# EAGLE design V0p2_Main_PCB2 (EAGLE 6.5.0)
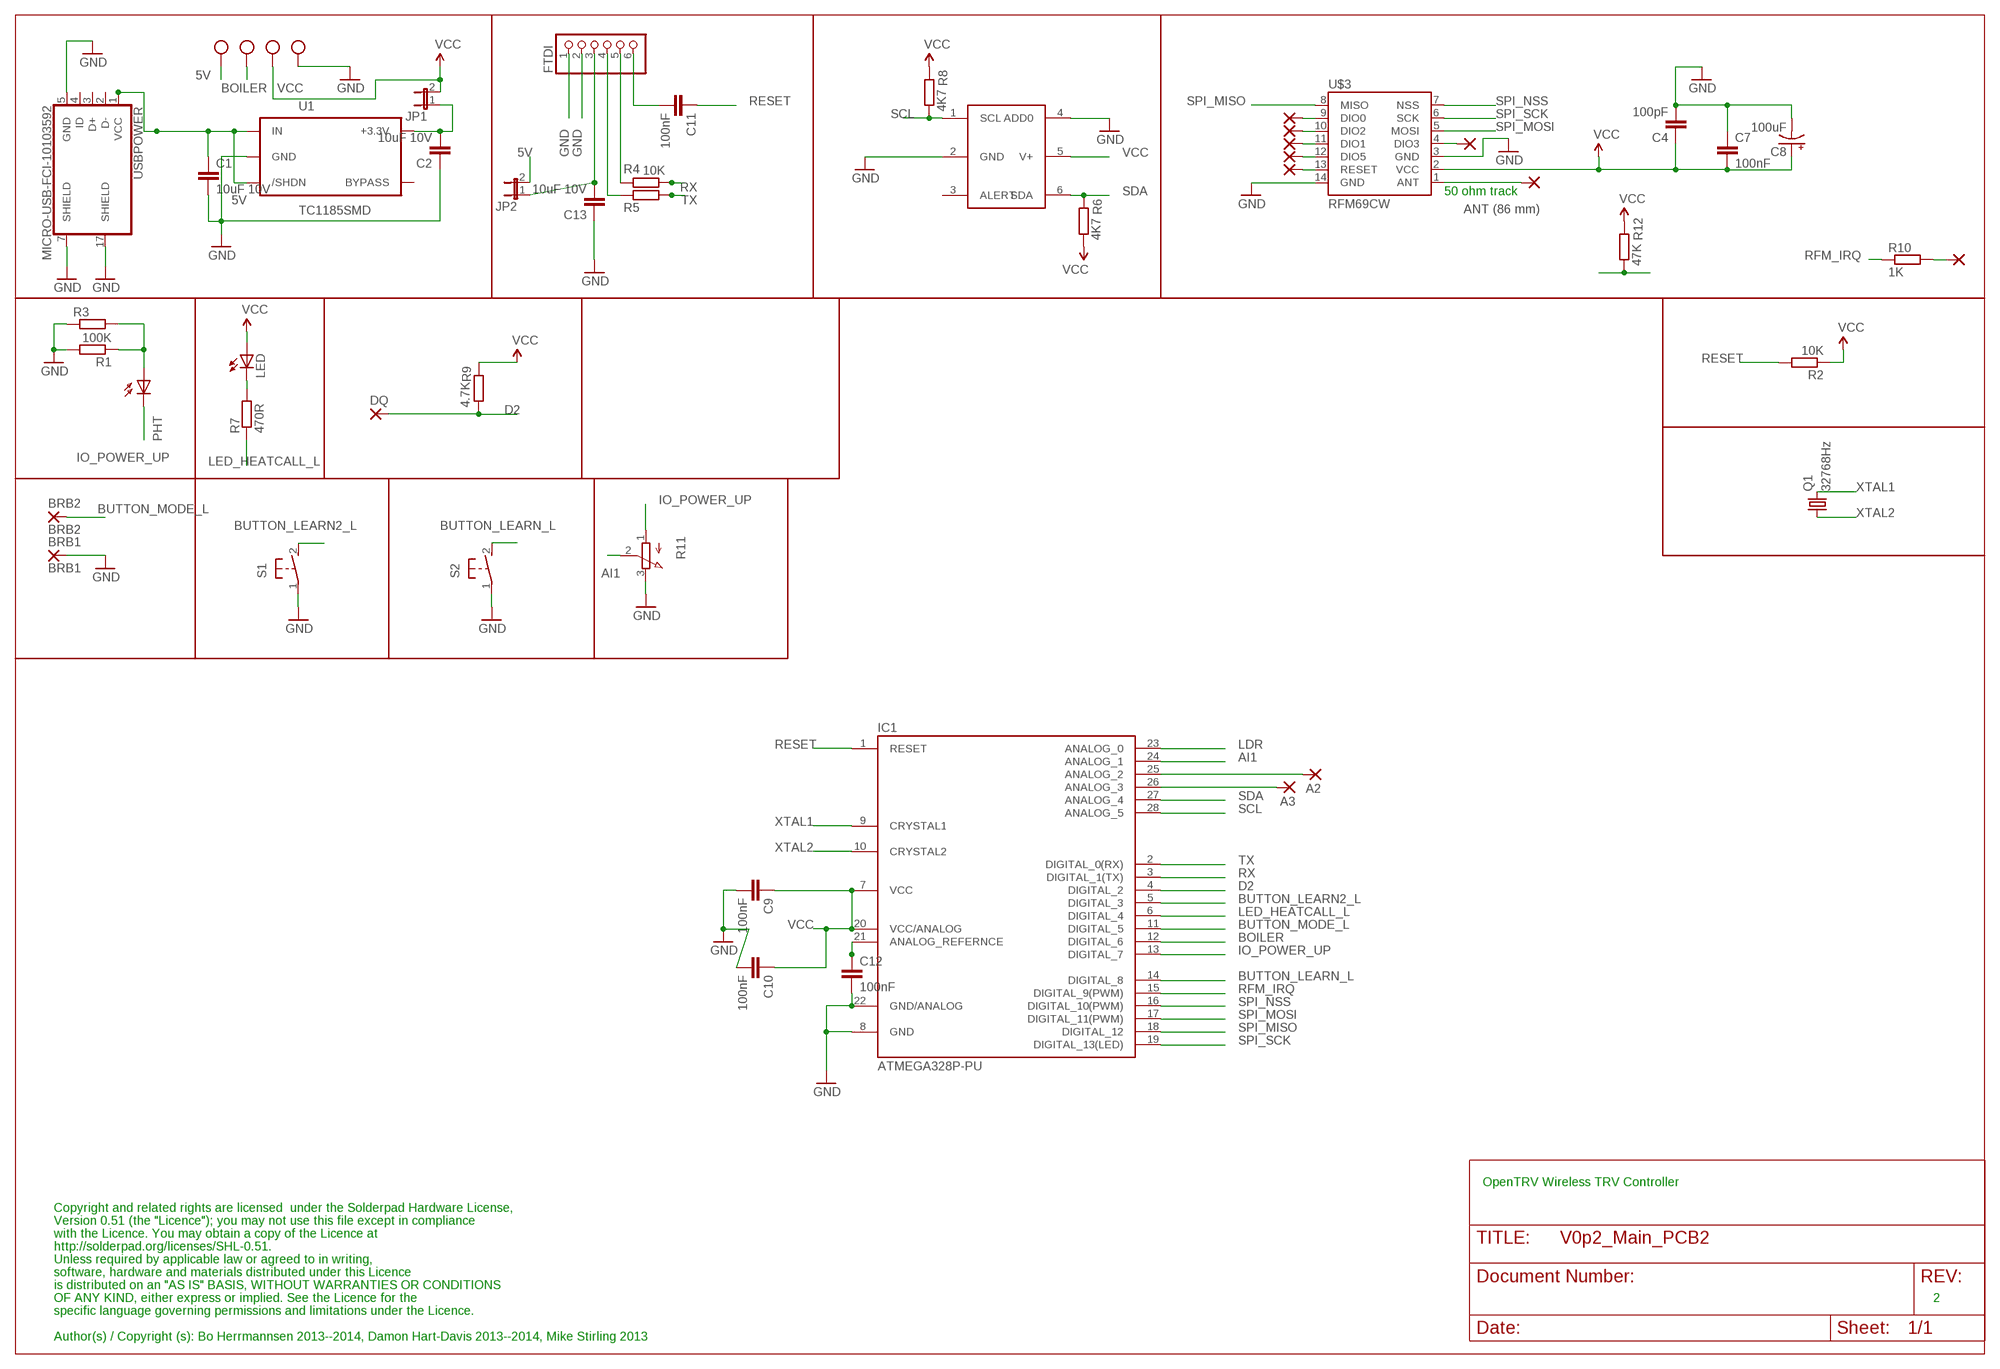
[diagram p0: schematic, sheet 1]

## Parts
A2  2,15/1,0  [2,15/1,0]
A3  2,15/1,0  [2,15/1,0]
ANT  ANT (86 mm)  2,15/1,0  [2,15/1,0]
BRB1  BRB1  2,15/1,0  [2,15/1,0]
BRB2  BRB2  2,15/1,0  [2,15/1,0]
C1  10uF 10V  C-EUC0603  [C0603]
C2  10uF 10V  C-EUC0603  [C0603]
C4  100pF  C-EUC0603  [C0603]
C7  100nF  C-EUC0603  [C0603]
C8  100uF  CAP_POL1206  [EIA3216]
C9  100nF  C-EUC0603  [C0603]
C10  100nF  C-EUC0603  [C0603]
C11  100nF  C-EUC0603  [C0603]
C12  100nF  C-EUC0603  [C0603]
C13  10uF 10V  C-EUC0603  [C0603]
DIO0  ANT (86 mm)  2,15/1,0  [2,15/1,0]
DIO1  ANT (86 mm)  2,15/1,0  [2,15/1,0]
DIO2  ANT (86 mm)  2,15/1,0  [2,15/1,0]
DIO3  ANT (86 mm)  2,15/1,0  [2,15/1,0]
DIO5  ANT (86 mm)  2,15/1,0  [2,15/1,0]
DQ  2,15/1,0  [2,15/1,0]
FTDI  PINHD-1X6/90  [1X06/90]
IC1  ATMEGA328P-PU  ATMEGA8-PU  [DIL28-3]
IRQ  ANT (86 mm)  2,15/1,0  [2,15/1,0]
JP1  JP1E  [JP1]
JP2  JP1E  [JP1]
LED  LED3MM  [LED3MM]
PHT  BPX65  [BPX65]
Q1  32768Hz  MC-306  [MC-306]
R1  100K  R-EU_R0603  [R0603]
R2  10K  R-EU_R0603  [R0603]
R3  R-EU_0309/V  [0309V]
R4  10K  R-EU_R0603  [R0603]
R5  10K  R-EU_R0603  [R0603]
R6  4K7  R-EU_R0603  [R0603]
R7  470R  R-EU_R0603  [R0603]
R8  4K7  R-EU_R0603  [R0603]
R9  4.7K  R-EU_R0603  [R0603]
R10  1K  R-EU_R0603  [R0603]
R11  EVUE2A  [EVUE]
R12  47K  R-EU_R0603  [R0603]
RST  ANT (86 mm)  2,15/1,0  [2,15/1,0]
S1  31-XX  [B3F-31XX]
S2  31-XX  [B3F-31XX]
TMP1  TMP1  TMP112  [TMP112]
U1  TC1185SMD  [TC1185]
U$3  RFM69CW  RFM69SMD  [RFM69]
USBPOWER  MICRO-USB-FCI-10103592  [MICRO-USB-FCI-10103592]
X1  W237-102  [SCREWTERMINAL]
X2  W237-102  [SCREWTERMINAL]

## Nets
5V [supply]: C1.1 JP2.2 U1.1(IN) U1.3(/SHDN) USBPOWER.1(VCC) X1.2
AI1: IC1.24(ANALOG_1) R11.2(S)
BOILER: IC1.12(DIGITAL_6) X1.1
BUTTON_LEARN2_L: IC1.5(DIGITAL_3) S1.2(S)
BUTTON_LEARN_L: IC1.14(DIGITAL_8) S2.2(S)
BUTTON_MODE_L: BRB2.1(P) IC1.11(DIGITAL_5)
D2: DQ.1(P) IC1.4(DIGITAL_2) R9.1
GND [supply]: BRB1.1(P) C1.2 C2.1 C4.2 C7.1 C8.C(-) C9.2 C10.2 C12.2 C13.1 FTDI.1 FTDI.2 IC1.8(GND) IC1.22(GND/ANALOG) R1.2 R3.1 R11.3(E) S1.1(P) S2.1(P) TMP1.2(GND) TMP1.4(ADD0) U1.2(GND) U$3.3(GND) U$3.14(GND) USBPOWER.5(GND) USBPOWER.7(SHIELD) USBPOWER.17(SHIELD) X2.2
IO_POWER_UP [supply]: IC1.13(DIGITAL_7) PHT.K(C) R11.1(A)
LDR: IC1.23(ANALOG_0) PHT.A R1.1 R3.2
LED_HEATCALL_L: IC1.6(DIGITAL_4) R7.1
N$1: C11.2 FTDI.6
N$3: FTDI.4 R5.2
N$5: FTDI.5 R4.2
N$6 [supply]: C12.1 IC1.21(ANALOG_REFERNCE)
N$7: IRQ.1(P) R10.2
N$8 [supply]: C2.2 JP1.1 U1.5(+3.3V)
N$11 [supply]: C13.2 FTDI.3 JP2.1
N$13: LED.K(C) R7.2
N$14: DIO0.1(P) U$3.9(DIO0)
N$15: DIO2.1(P) U$3.10(DIO2)
N$16: DIO1.1(P) U$3.11(DIO1)
N$17: DIO5.1(P) U$3.12(DIO5)
N$20: RST.1(P) U$3.13(RESET)
N$21: DIO3.1(P) U$3.4(DIO3)
N$24: A2.1(P) IC1.25(ANALOG_2)
N$25: A3.1(P) IC1.26(ANALOG_3)
N$26 [ant]: ANT.1(P) U$3.1(ANT)
RESET: C11.1 IC1.1(RESET) R2.2
RFM_IRQ: IC1.15(DIGITAL_9(PWM)) R10.1
RX: IC1.3(DIGITAL_1(TX)) R4.1
SCL: IC1.28(ANALOG_5) R8.1 TMP1.1(SCL)
SDA: IC1.27(ANALOG_4) R6.2 TMP1.6(SDA)
SPI_MISO: IC1.18(DIGITAL_12) U$3.8(MISO)
SPI_MOSI: IC1.17(DIGITAL_11(PWM)) U$3.5(MOSI)
SPI_NSS: IC1.16(DIGITAL_10(PWM)) R12.1 U$3.7(NSS)
SPI_SCK: IC1.19(DIGITAL_13(LED)) U$3.6(SCK)
TX: IC1.2(DIGITAL_0(RX)) R5.1
VCC [supply]: C4.1 C7.2 C8.A(+) C9.1 C10.1 IC1.7(VCC) IC1.20(VCC/ANALOG) JP1.2 LED.A R2.1 R6.1 R8.2 R9.2 R12.2 TMP1.5(V+) U$3.2(VCC) X2.1
XTAL1: IC1.9(CRYSTAL1) Q1.4
XTAL2: IC1.10(CRYSTAL2) Q1.1
Unconnected: TMP1.3(ALERT) U1.4(BYPASS) USBPOWER.2(D-) USBPOWER.3(D+) USBPOWER.4(ID)

## Notes on the sheet
- 50 ohm track
- OpenTRV Wireless TRV Controller
- Copyright and related rights are licensed  under the Solderpad Hardware License,
- Version 0.51 (the "Licence"); you may not use this file except in compliance
- with the Licence. You may obtain a copy of the Licence at
- http://solderpad.org/licenses/SHL-0.51.
- Unless required by applicable law or agreed to in writing,
- software, hardware and materials distributed under this Licence
- is distributed on an "AS IS" BASIS, WITHOUT WARRANTIES OR CONDITIONS
- OF ANY KIND, either express or implied. See the Licence for the | 2
- specific language governing permissions and limitations under the Licence.
- Author(s) / Copyright (s): Bo Herrmannsen 2013--2014, Damon Hart-Davis 2013--2014, Mike Stirling 2013

## Library data of the parts
A2 A3 ANT BRB1 BRB2 DIO0 DIO1-DIO3 DIO5 DQ IRQ RST = wirepad:2,15/1,0: THROUGH-HOLE PAD
C1 C2 C4 C7 C9-C13 = resistor:C-EU: CAPACITOR, European symbol
C8 = SparkFun-Passives:CAP_POL: Capacitor Polarized These are standard SMD and PTH capacitors. Normally 10uF, 47uF, and 100uF in electrolytic and tantalum varieties. Always verify the external diameter of the through hole cap, it varies with capacity, voltage, and manufacturer. The EIA devices should be standard.
FTDI = pinhead:PINHD-1X6: PIN HEADER
IC1 = Arduino-AVR:ATMEGA8-PU
JP1 JP2 = jumper:JP1E: JUMPER
LED = adafruit:LED: LED OSRAM: - CHIPLED LG R971, LG N971, LY N971, LG Q971, LY Q971, LO R971, LY R971 LH N974, LH R974 LS Q976, LO Q976, LY Q976 LO Q996 - Hyper CHIPLED LW Q18S LB Q993, LB Q99A, LB R99A - SideLED LS A670, LO A670, LY A670, LG A670, LP A670 LB A673, LV A673, LT A673, LW A673 LH A674 LY A675 LS A676, LA A676, LO A676, LY A676, LW A676 LS A679, LY A679, LG A679 - Hyper Micro SIDELED® LS Y876, LA Y876, LO Y876, LY Y876 LT Y87S - SmartLED LW L88C, LW L88S LB L89C, LB L89S, LG L890 LS L89K, LO L89K, LY L89K LS L896, LA L896, LO L896, LY L896 - TOPLED LS T670, LO T670, LY T670, LG T670, LP T670 LSG T670, LSP T670, LSY T670, LOP T670, LYG T670 LG T671, LOG T671, LSG T671 LB T673, LV T673, LT T673, LW T673 LH T674 LS T676, LA T676, LO T676, LY T676, LB T676, LH T676, LSB T676, LW T676 LB T67C, LV T67C, LT T67C, LS T67K, LO T67K, LY T67K, LW E67C LS E67B, LA E67B, LO E67B, LY E67B, LB E67C, LV E67C, LT E67C LW T67C LS T679, LY T679, LG T679 LS T770, LO T770, LY T770, LG T770, LP T770 LB T773, LV T773, LT T773, LW T773 LH T774 LS E675, LA E675, LY E675, LS T675 LS T776, LA T776, LO T776, LY T776, LB T776 LHGB T686 LT T68C, LB T68C - Hyper Mini TOPLED® LB M676 - Mini TOPLED Santana® LG M470 LS M47K, LO M47K, LY M47K Source: http://www.osram.convergy.de/
PHT = opto-trans-siemens:BPX65: PHOTO DIODE; MPN: BPX65.; OC_FARNELL: 327451; OC_NEWARK: 06WX2764
Q1 = crystal:MC-306: kHz RANGE CRYSTAL UNIT SMD Source: MC-306_405_406_E07X.PDF Homepage <http://www.epsontoyocom.co.jp>; MPN: MC-306 60.0KHZ 100PPM ,12.5PF; OC_FARNELL: 1278040; OC_NEWARK: 31M5576
R1-R10 R12 = resistor:R-EU_: RESISTOR, European symbol
R11 = pot:EVU: 9 mm Square Rotary Potentiometers Source: Panasonic
S1 S2 = adafruit:31-XX: OMRON SWITCH Now with beefier pads!
TMP1 = TMP112:TMP112
U1 = 3.3VREG:TC1185
U$3 = RFM69:RFM69: The RFM22 is a low-power, low cost radio that is capable of operating in the 434MHz and 900MHz open bands. It's frequency is software defined and there are some very good libraries written for it.
USBPOWER = micro-usb-fci-10103592:MICRO-USB-FCI-10103592: Micro USB B Connector RS No: 714-2334 MRF No: 10103592-0001LF
X1 X2 = screwterminal:W237-102: Screw terminal 3.5mm Pitch RS No: 710-0444 MRF No:1776275-2; MPN: 237-102; OC_FARNELL: unknown; OC_NEWARK: 70K9898

## Net classes
0 default: width 0.203 mm
1 supply: width 0.406 mm, clearance 0.203 mm
2 ant: width 2.184 mm

## Board
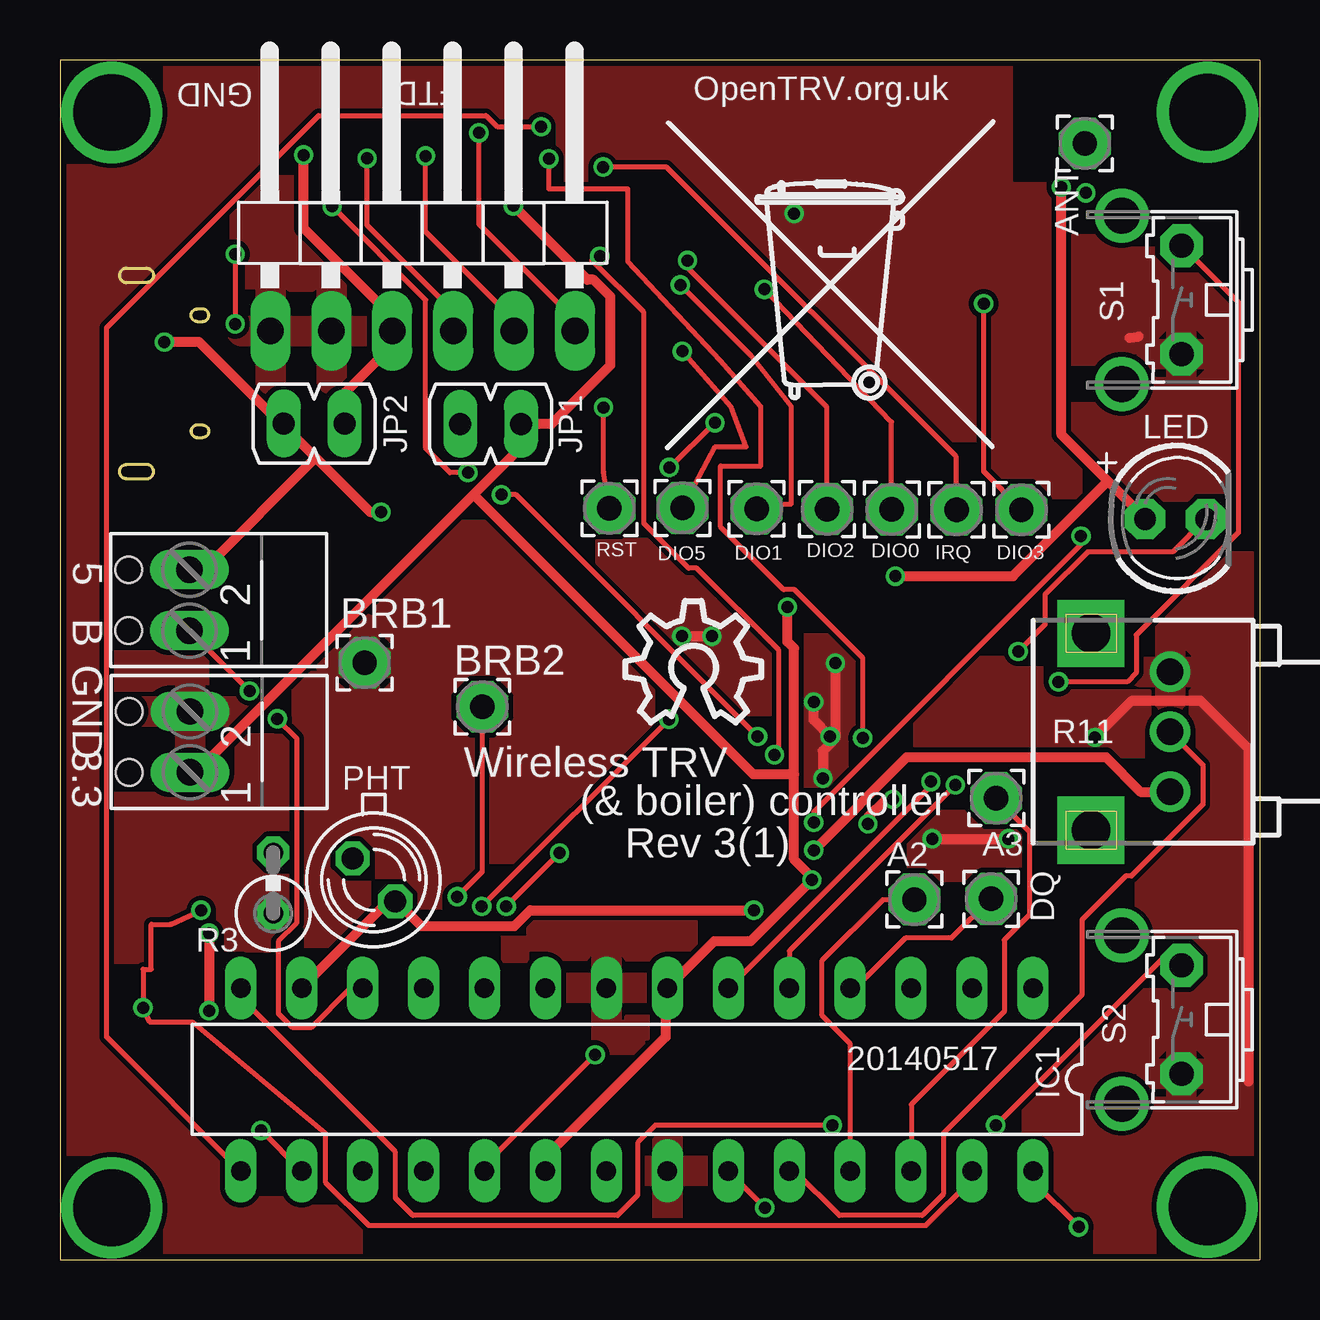
[diagram p1: board, top side]
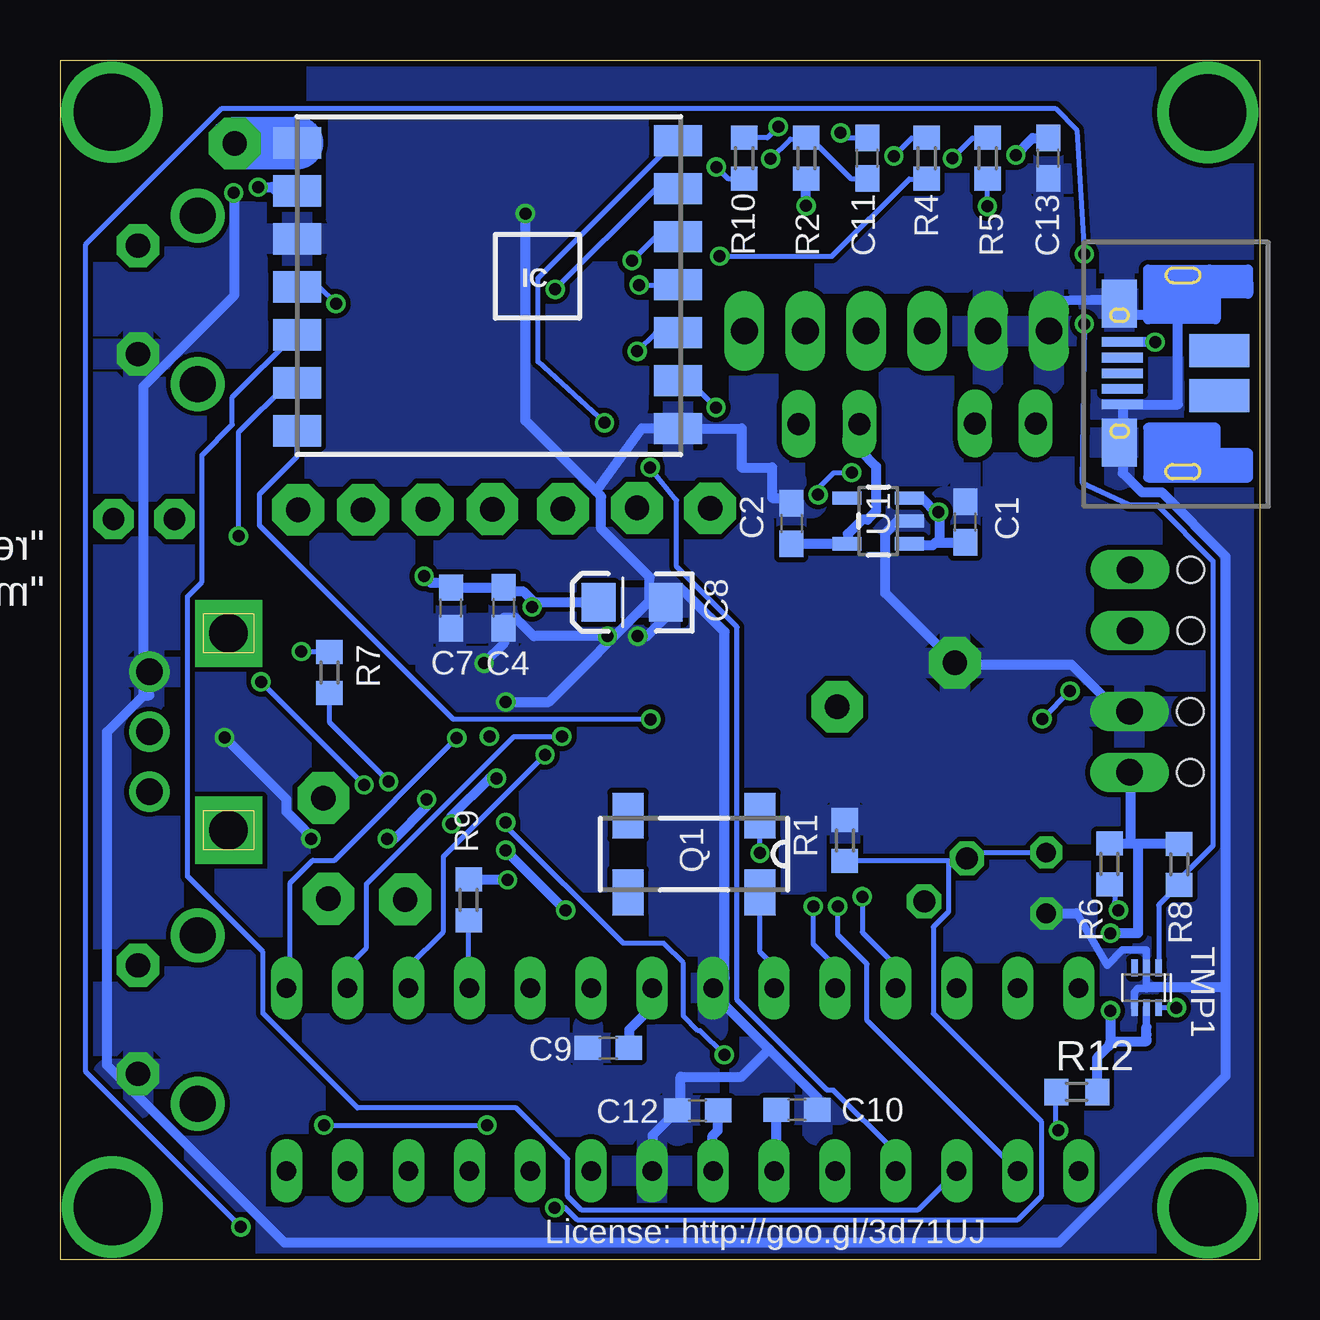
[diagram p2: board, bottom side, seen from below]

Size 50 x 50 mm. Coordinates in mm from the lower left corner, seen from the top.
Outline: 0,0 50,0 50,50 0,50 0,0
Copper layers (1*16): Top 0.035mm / dielectric 1.5mm / Bottom 0.035mm
Design rules "PMServicesStd *": minimum track width 8mil, minimum drill 0.5mm, track to track 8mil, track to pad 8mil, pad to pad 8mil, via to via 8mil, smd to smd 0mil, copper to edge 10mil, drill to drill 10mil, minimum pad ring 10mil, minimum via ring 6mil, stop-mask expansion 2mil, vias tented up to drill 100mil, thermal gap 10mil

### Footprints (pad centres in the part's own frame; a part is rotated, then mirrored left to right if it is on the bottom)
2,15/1,0 = drill 1.016 pad 2.159 octagon: 1 0,0
C0603 = smd 1.1 x 1: 1 -0.85,0; 2 0.85,0
EIA3216 = smd 1.4 x 1.6: A 1.4,0; C -1.4,0
1X06/90 = drill 1.118 long: 1 -6.35,-3.81; 2 -3.81,-3.81; 3 -1.27,-3.81; 4 1.27,-3.81; 5 3.81,-3.81; 6 6.35,-3.81
DIL28-3 = drill 0.813 long: 1 -16.51,-3.81; 2 -13.97,-3.81; 3 -11.43,-3.81; 4 -8.89,-3.81; 5 -6.35,-3.81; 6 -3.81,-3.81; 7 -1.27,-3.81; 8 1.27,-3.81; 9 3.81,-3.81; 10 6.35,-3.81; 11 8.89,-3.81; 12 11.43,-3.81; 13 13.97,-3.81; 14 16.51,-3.81; 15 16.51,3.81; 16 13.97,3.81; 17 11.43,3.81; 18 8.89,3.81; 19 6.35,3.81; 20 3.81,3.81; 21 1.27,3.81; 22 -1.27,3.81; 23 -3.81,3.81; 24 -6.35,3.81; 25 -8.89,3.81; 26 -11.43,3.81; 27 -13.97,3.81; 28 -16.51,3.81
JP1 = drill 0.914 long: 1 0,-1.27; 2 0,1.27
LED3MM = drill 0.914 pad 1.676 octagon: A -1.27,0; K 1.27,0
BPX65 = drill 0.914 octagon: A -0.889,-0.889; K 0.889,0.889
MC-306 = smd 1.3 x 1.9: 1 -2.75,-1.6; 2 2.75,-1.6; 3 2.75,1.6; 4 -2.75,1.6
R0603 = smd 1 x 1.1: 1 -0.85,0; 2 0.85,0
0309V = drill 0.813 octagon: 1 -1.27,0; 2 1.27,0
EVUE = drill 1.1 pad 1.676: 1 0,-2.5; 2 0,0; 3 0,2.5 | drill 1.6 pad 2.8 square: M1 -3.3,4.1; M2 -3.3,-4.1
B3F-31XX = drill 1.016 pad 1.778 octagon: 1 -2.261,-1.245; 2 2.261,-1.245 | drill 1.499 pad 2.032: 3 -3.505,1.245; 4 3.505,1.245
TMP112 = smd 0.285 x 0.7: 1 -0.5,-0.825; 2 0,-0.825; 3 0.5,-0.825; 4 0.5,0.825; 5 0,0.825; 6 -0.5,0.825
TC1185 = smd 0.55 x 1.2: 1 -0.95,-1.3; 2 0,-1.3; 3 0.95,-1.3; 4 0.95,1.3; 5 -0.95,1.3
RFM69 = smd 2 x 1.3: 1 8,-6.27; 2 8,-4.27; 3 8,-2.27; 4 8,-0.27; 5 8,1.73; 6 8,3.73; 7 8,5.73; 8 -7.875,-6.365; 9 -7.875,-4.365; 10 -7.875,-2.365; 11 -7.875,-0.365; 12 -7.875,1.635; 13 -7.875,3.635; 14 -7.875,5.635
MICRO-USB-FCI-10103592 = smd 0.4 x 1.71: 1 3.84,2.51; 2 3.19,2.51; 3 2.54,2.51; 4 1.89,2.51; 5 1.24,2.51 | smd 2 x 1.46: 7 -0.36,2.64; 17 5.44,2.64 | smd 1.375 x 2.5: 11 1.603,-1.52; 12 3.478,-1.52
SCREWTERMINAL = drill 1.1 long: 1 -1.27,-1.27; 2 1.27,-1.27 | hole 1.1: -1.27,1.27; 1.27,1.27

### Placement (x,y rotation side)
A2  35.61,15.01 0 top
A3  39.02,19.23 180 top
ANT  42.72,46.52 270 top
BRB1  12.7,24.87 0 top
BRB2  17.6,23.04 180 top
C1  12.27,30.74 90 bottom
C2  19.51,30.68 270 bottom
C4  31.51,27.17 270 bottom
C7  33.7,27.16 90 bottom
C8  26.15,27.39 180 bottom
C9  27.15,8.82 180 bottom
C10  19.28,6.24 0 bottom
C11  16.35,45.91 90 bottom
C12  23.42,6.21 180 bottom
C13  8.8,45.91 90 bottom
DIO0  34.67,31.27 180 top
DIO1  29.04,31.29 180 top
DIO2  31.98,31.28 180 top
DIO3  40.08,31.25 180 top
DIO5  25.95,31.33 180 top
DQ  38.81,15.03 0 top
FTDI  15.12,42.52 0 top
IC1  24.05,7.51 180 top
IRQ  37.37,31.25 180 top
JP1  17.95,34.83 270 top
JP2  10.59,34.85 90 top
LED  46.5,30.86 0 top
PHT  13.09,15.82 270 top
Q1  23.57,16.9 180 bottom
R1  17.29,17.47 90 bottom
R2  18.89,45.91 90 bottom
R3  8.89,15.7 90 top
R4  13.87,45.91 90 bottom
R5  11.33,45.91 90 bottom
R6  6.25,16.49 270 bottom
R7  38.77,24.47 90 bottom
R8  3.35,16.47 90 bottom
R9  32.96,14.99 90 bottom
R10  21.48,45.91 270 bottom
R11  46.27,22 0 top
R12  7.62,6.99 0 bottom
RST  22.9,31.31 180 top
S1  45.5,40 90 top
S2  45.5,10 90 top
TMP1  4.71,11.33 180 bottom
U1  15.89,30.79 90 bottom
U$1  [OSHW_10X200_NOTEXT]  23.56,22.38 0 top
U$2  [TONNE]  31.96,37.88 0 top
U$3  32.12,40.27 180 bottom
USBPOWER  3.2,34.4 90 bottom
X1  4.13,27.48 90 top
X2  4.15,21.57 90 top

### Tracks (layer width: path | path; a pad name or v marks a point on that pad's centre or on a via)
5V  (via drill 0.5)
  Top 0.406: v4.35,38.24 5.8,38.24 9.18,34.86 JP2.2 9.4,34.68 10.66,33.42 | v13.38,31.16 12.92,31.16 10.66,33.42 | 10.66,33.42 6,28.76 5.42,28.76 X1.2
  Bottom 0.406: 13.32,29.88 13.52,29.88 13.62,29.78 14.54,29.78 14.58,29.82 U1.1 | 13.32,29.88 C1.1 | 13.44,31.1 13.32,30.98 13.32,29.88 | 13.44,31.1 14.06,31.72 14.58,31.72 U1.3 | v4.35,38.24 USBPOWER.1 | v13.38,31.16 13.44,31.1
AI1
  Top 0.203: IC1.24 30.4,3.68 30.64,3.68 32.48,1.84 35.94,1.84 36.82,2.72 36.82,5.26 42.6,11.04 42.6,14.16 44.42,15.98 44.66,15.98 47.64,18.96 47.64,20.62 R11.2
BOILER  (via drill 0.5)
  Top 0.203: v9.06,22.54 9.86,21.74 9.86,14.02 9.1,13.26 9.1,10.26 9.68,9.68 10.48,9.68 12.1,11.3 12.6,11.3 IC1.12 | v7.9,23.7 X1.1
  Bottom 0.203: v7.9,23.7 v9.06,22.54
BUTTON_LEARN2_L  (via drill 0.5)
  Top 0.203: v37.32,19.78 30.4,12.86 IC1.5 | v41.62,24.08 44.48,24.08 44.86,24.46 44.86,26.04 49.12,30.3 49.12,39.9 46.76,42.26 S1.2
  Bottom 0.203: v41.62,24.08 v37.32,19.78
BUTTON_LEARN_L  (via drill 0.5)
  Top 0.203: v32.2,5.6 24.82,5.6 24.08,4.86 24.08,2.68 23.24,1.84 14.7,1.84 13.98,2.56 13.98,4.48 7.54,10.92 7.54,11.3 IC1.14 | v39,5.6 45.94,12.54 46.48,12.54 46.74,12.28 S2.2
  Bottom 0.203: v39,5.6 v32.2,5.6
BUTTON_MODE_L  (via drill 0.5)
  Top 0.203: v16.56,15.12 17.6,16.16 BRB2.1
  Bottom 0.203: v16.56,15.12 16.56,13.64 15.16,12.24 IC1.11
D2
  Top 0.203: IC1.4 33.16,11.32 35.24,13.4 37.16,13.4 DQ.1
  Bottom 0.203: R9.1 32.96,14.12 32.96,11.34 IC1.4
GND  (via drill 0.5)
  Top 0.406: v31.42,23.24 31.42,22.48 v32.1,21.8 | v42.76,44.46 42.76,44.28 | 49.54,7.42 49.54,21.3 47.54,23.3 44.68,23.3 v43.14,21.76 | v36.36,17.54 v39.54,17.54 | v34.72,19.18 34.42,19.18 33.68,18.44 v33.68,18.16 | v31.8,20.06 31.8,21.2 32.32,21.72 v32.32,24.86 | v25.92,25.98 v27.18,25.98 | 44.58,38.42 44.97,38.48
  Bottom 0.305: TMP1.4 5.21,11.14 5.08,11.3 4.71,11.3 4.71,11.34 TMP1.2 4.71,12.9 5.71,12.9 6.35,12.27 7.62,14.43
  Bottom 0.406: v30.6,43.6 30.6,34.96 27.66,32.02 | 27.66,32.02 27.44,31.8 27.44,30.46 25.42,28.44 25.42,27.44 29.62,23.24 v31.42,23.24 | v42.76,44.46 42.76,44.18 42.72,44.14 42.72,40.2 46.52,36.4 46.52,23.52 | 46.52,23.52 48.04,22 48.04,8.1 40.64,0.7 8.36,0.7 1.42,7.64 1.42,11.34 | 1.42,11.34 1.42,29.32 4.08,31.98 4.9,31.98 5.7,32.78 5.7,34.04 | 5.7,34.04 USBPOWER.5 3.4,35.64 3.4,39.37 5.84,39.37 USBPOWER.17 5.84,40.01 6.99,40.01 8.89,39.98 FTDI.1 | U1.2 15.1,30.78 15.6,30.28 15.6,27.78 BRB1.1 12.5,24.8 7.84,24.8 5.9,22.86 5.44,22.86 X2.2 5.42,22.86 | IC1.22 25.3,3.7 25.3,5.18 C12.2 24.13,6.21 24.13,7.62 21.59,7.62 20.45,8.75 20.45,8.77 | 20.45,8.77 22.76,11.08 22.76,11.3 IC1.8 | 20.45,8.77 18.44,6.76 C10.2 | USBPOWER.7 5.7,34.04 | U$3.3 40.12,42.56 U$3.3 | 46.52,23.52 46.27,23.52 R11.3 | 1.42,11.34 4.71,11.34 | v43.14,21.76 40.56,19.18 40.56,18.66 39.72,17.82 39.72,17.72 v39.54,17.54 | v36.36,17.54 36.06,17.54 34.72,18.88 v34.72,19.18 | v33.68,18.16 33.68,18.48 32.1,20.06 v31.8,20.06 | v32.32,24.86 31.5,25.68 31.5,26.28 31.48,26.3 31.48,26.32 31.5,26.34 31.5,26.74 31.02,26.74 30.26,25.98 v27.18,25.98 | v25.92,25.98 25.54,25.98 24.76,26.76 24.76,27.36 24.78,27.38 24.78,27.4 24.76,27.42 24.76,27.98 24.74,28 24.14,28 22.3,26.16 22.3,11.72 IC1.8 | IC1.8 22.48,11.88 IC1.8 | U$3.3 39.76,42.68 U$3.3 | R3.1 7.62,14.43 | 27.66,32.02 25.76,34.64 U$3.14 21.59,34.64 21.59,33.02 20.32,33.02 20.32,31.75 19.51,31.75 C2.1
  pour Bottom: 0,0 50,0 50,50 44.6,50 44.6,44.28 39.09,44.27 39.09,50 0,50
  pour Top: 0,50 0,0 50,0 50,50 44.6,50 44.6,44.28 39.09,44.27 39.09,50
IO_POWER_UP  (via drill 0.5)
  Top 0.406: IC1.13 13.68,14.92 13.96,14.92 PHT.K 14.14,14.82 15.06,13.9 18.94,13.9 19.6,14.56 v28.92,14.56 | R11.1 45.04,19.5 43.6,20.94 35.3,20.94 v31.42,17.06
  Bottom 0.406: v28.92,14.56 v31.42,17.06
LDR  (via drill 0.5)
  Top 0.203: v29.38,2.16 27.86,3.68 IC1.23
  Bottom 0.203: 12.96,16.62 12.28,16.62 PHT.A 12.1,16.74 11.88,16.96 R3.2 | 12.96,16.62 R1.1 | v29.38,2.16 28.94,2.16 28.42,1.64 10.1,1.64 9.1,2.64 9.1,5.76 13.6,10.26 13.6,13.86 12.96,14.5 12.96,16.62
LED_HEATCALL_L  (via drill 0.5)
  Top 0.203: v36.3,19.92 36.3,19.74 27.86,11.3 IC1.6
  Bottom 0.203: v36.3,19.92 38.76,22.38 R7.1
N$1  (via drill 0.5)
  Top 0.203: v17.46,46.96 17.46,43.16 21.46,39.16 FTDI.6
  Bottom 0.203: v17.46,46.96 17.26,46.76 C11.2
N$3  (via drill 0.5)
  Top 0.203: v12.8,45.9 12.8,43.12 16.38,39.54 FTDI.4
  Bottom 0.203: v12.8,45.9 11.96,46.74 11.34,46.74 R5.2
N$4  (via drill 3.2)
  other vias: 2.16,47.81
N$5  (via drill 0.5)
  Top 0.203: v15.24,46 15.24,42.84 18.92,39.16 FTDI.5
  Bottom 0.203: v15.24,46 14.5,46.74 13.88,46.74 R4.2
N$6
  Bottom 0.406: C12.1 22.58,5.38 22.8,5.16 22.8,3.72 IC1.21
N$7  (via drill 0.5)
  Top 0.203: v22.64,45.54 25.28,45.54 37.36,33.46 IRQ.1
  Bottom 0.203: v22.64,45.54 22.16,45.06 R10.2
N$8
  Bottom 0.406: C2.2 17.2,29.82 U1.5 17.16,30.04 17.16,30.24 16.56,30.84 16.34,30.84 15.98,31.2 15.98,33.06 16.66,33.74 16.66,34.82 JP1.1
N$11  (via drill 0.5)
  Top 0.406: v10.16,46.04 10.16,42.98 13.84,39.3 FTDI.3 13.76,38.52 13.76,38.02 11.88,36.14 11.88,34.86 JP2.1
  Bottom 0.406: v10.16,46.04 9.46,46.74 8.8,46.74 C13.2
N$12  (via drill 3.2)
  other vias: 47.83,2.19
N$13  (via drill 0.5)
  Top 0.203: v39.94,25.34 41.06,26.46 41.06,27.72 42.84,29.5 46.38,29.5 47.76,30.88 LED.K
  Bottom 0.203: v39.94,25.34 38.78,25.34 R7.2
N$14  (via drill 0.5)
  Top 0.203: v29.36,40.44 34.66,34.91 DIO0.1
  Bottom 0.203: v29.36,40.44 25.18,44.62 24.26,44.62 U$3.9
N$15  (via drill 0.5)
  Top 0.203: v26.16,41.64 26.16,41.34 31.96,35.54 31.96,31.28 DIO2.1
  Bottom 0.203: v26.16,41.64 25.18,42.62 24.26,42.62 U$3.10
N$16  (via drill 0.5)
  Top 0.203: v25.86,40.62 28.82,37.66 30.48,35.56 30.48,31.5 30.09,31.5 29.02,31.3 DIO1.1
  Bottom 0.203: v25.86,40.62 24.26,40.62 U$3.11
N$17  (via drill 0.5)
  Top 0.203: v25.94,37.86 27.96,35.56 28.59,33.88 27.3,33.88 DIO5.1
  Bottom 0.203: v25.94,37.86 25.18,38.62 24.26,38.62 U$3.12
N$19  (via drill 3.2)
  other vias: 47.83,47.82
N$20  (via drill 0.5)
  Top 0.203: v22.66,35.52 22.66,32.83 RST.1
  Bottom 0.203: v22.66,35.52 23.76,36.62 24.24,36.62 U$3.13
N$21  (via drill 0.5)
  Top 0.203: v38.5,39.84 38.5,32.84 DIO3.1
  Bottom 0.203: v38.5,39.84 39.2,40.54 40.1,40.54 U$3.4
N$22  (via drill 3.2)
  other vias: 2.16,2.16
N$24
  Top 0.203: IC1.25 32.92,3.7 32.92,9.02 31.74,10.2 31.74,12.44 34.3,15 A2.1
N$25
  Top 0.203: IC1.26 35.48,6.46 39.36,10.34 39.36,13.32 40.4,14.36 40.4,17.84 A3.1
N$26
  Bottom 2.184: U$3.1 42.7,46.54 ANT.1
RESET  (via drill 0.5)
  Top 0.203: v20.38,45.88 20.38,44.62 23.67,44.62 23.67,41.6 27.54,37.46 29.21,35.56 29.21,33.08 27.54,33.08 27.54,30.54 30.16,27.92 30.62,27.92 33.46,25.08 v33.46,21.74
  Bottom 0.203: C11.1 17.04,45.06 18.72,46.74 18.88,46.74 R2.2 18.98,46.7 19.56,46.7 v20.38,45.88 | v33.46,21.74 38.56,16.64 39.46,16.64 40.4,15.7 40.4,11.46 40.54,11.32 IC1.1
RFM_IRQ  (via drill 0.5)
  Top 0.203: v20.06,47.22 18.22,47.22 17.76,47.68 10.78,47.68 1.94,38.84 1.94,9.28 7.52,3.7 IC1.15
  Bottom 0.203: v20.06,47.22 20.52,46.76 21.46,46.76 R10.1
RX  (via drill 0.5)
  Top 0.203: v22.5,41.82 22.16,41.66 24.34,39.48 24.34,30.68 26.2,28.82 26.54,28.82 29.96,25.4 29.96,21.22 v29.78,21.04
  Bottom 0.203: v22.5,41.82 17.82,41.82 14.6,45.04 13.88,45.04 R4.1 | v29.78,21.04 34.02,16.8 34.02,13.66 35.46,12.22 35.46,11.32 IC1.3
SCL  (via drill 0.5)
  Top 0.203: v7.3,41.91 v7.3,39 | v42.46,1.36 40.56,3.26 40.56,3.68 IC1.28
  Bottom 0.203: TMP1.1 | 4.16,12.06 TMP1.1 | TMP1.1 4.2,12.26 4.2,14.78 R8.1 3.32,15.72 3.32,15.86 1.94,17.24 1.94,29.12 4.28,31.46 5.42,31.46 7.4,32.39 v7.3,39 | v7.3,41.91 7.62,47.08 8.52,47.98 43.26,47.98 48.92,42.32 48.92,7.82 v42.46,1.36
SDA  (via drill 0.5)
  Top 0.203: IC1.27 38,3.68 38,3.32 36.1,1.42 12.86,1.42 11.06,3.22 11.06,5.27 5.52,9.9 3.74,9.9 v3.46,10.5 3.46,12.1 3.81,12.1 3.81,13.97 4.61,13.97 v5.88,14.56
  Bottom 0.203: TMP1.6 4.1,10.5 v3.46,10.5 | v5.88,14.56 5.88,14.76 6.04,14.92 6.04,15.44 R6.2
SPI_MISO  (via drill 0.5)
  Top 0.203: v25.4,33.02 v27.3,34.88
  Bottom 0.203: v25.4,33.02 24.3,31.64 24.3,28.88 21.78,26.36 21.78,10.82 18.02,7.06 17.76,7.06 15.16,4.46 IC1.18 | v27.3,34.88 30.08,37.42 30.08,40.9 24.36,46.62 24.26,46.62 U$3.8
SPI_MOSI
  Bottom 0.203: U$3.5 40.22,38.54 42.82,35.94 42.82,34.8 44.08,33.54 44.08,28.24 44.68,27.64 44.68,15.96 41.54,12.82 41.54,10.26 37.6,6.32 30.98,6.32 28.84,4.18 28.84,2.64 28.26,2.06 14.24,2.06 12.62,3.68 IC1.17
SPI_NSS  (via drill 0.5)
  Top 0.203: v17.58,14.72 v25.38,22.52 | v8.38,5.38 10.06,3.7 IC1.16
  Bottom 0.203: v25.38,22.52 33.6,22.52 41.68,30.6 41.68,31.9 40.12,33.46 U$3.7 | v17.58,14.72 17.58,13.54 16.36,12.32 16.36,9.96 10.08,3.68 IC1.16 | v8.38,5.38 8.48,5.48 R12.1
SPI_SCK  (via drill 0.5)
  Top 0.203: v42.56,30.16 42.56,29.8 31.42,18.66 v31.42,18.22 | v22.31,8.53 17.7,3.92 IC1.19
  Bottom 0.203: v42.56,30.16 42.56,34.48 40.5,36.54 U$3.6 | v31.42,18.22 31.42,18.08 26.52,13.18 24.84,13.18 24.02,12.36 24.02,10.16 23.4,9.54 23.32,9.54 v22.31,8.53
TX  (via drill 0.5)
  Top 0.203: v11.34,43.9 15.24,40 15.24,33.82 16.26,32.8 v17,32.8 | v18.4,31.88 19,31.88 v29.08,21.8
  Bottom 0.203: v11.34,43.9 11.34,45.04 R5.1 | v17,32.8 17.74,32.8 18.4,32.14 v18.4,31.88 | v29.08,21.8 31.08,21.8 37.22,15.66 37.22,13 38,12.22 38,11.32 IC1.2
VCC  (via drill 0.5)
  Top 0.406: v18.9,43.92 21.98,40.84 22.24,40.84 22.94,40.14 22.94,37.28 20.5,34.84 JP1.2 19.14,34.64 19.14,33.78 17.24,31.88 | v41.74,44.7 41.74,34.38 43.68,32.44 | 43.68,32.44 45.24,30.88 LED.A | IC1.20 20.24,4.28 25.24,9.28 25.24,11.12 IC1.7 27.28,13.28 28.8,13.28 v31.34,15.82 31.26,16.02 30.6,16.68 30.6,20.22 | v30.32,27.2 30.32,25.76 30.6,25.48 30.6,20.22 | 43.68,32.44 39.72,28.48 v34.82,28.48 | 17.24,31.88 5.68,20.32 5.44,20.32 X2.1 | 17.24,31.88 28.9,20.22 30.6,20.22 | v6.21,13.6 v6.21,10.37
  Bottom 0.305: 4.72,9.7 4.71,9.82 TMP1.5
  Bottom 0.406: X2.1 5.38,20.1 5.38,17.34 | v18.9,43.92 18.9,45.04 R2.1 | v41.74,44.7 41.16,44.7 41.02,44.56 40.12,44.56 U$3.2 | 30.24,27.4 C8.A | 30.24,27.4 30.7,27.86 31.4,27.86 C4.1 C7.2 33.8,28.2 34.54,28.2 v34.82,28.48 | C10.1 20.14,6.22 20.14,3.78 20.22,3.7 IC1.20 | C9.1 26.28,8.84 26.28,9.58 25.32,10.54 25.32,11.3 IC1.7 | v31.34,15.82 32.96,15.82 R9.2 | v30.32,27.2 30.24,27.4 | 5.38,17.34 R6.1 | 5.07,17.34 3.36,17.34 R8.2 | 5.38,17.34 5.07,17.34 | 5.07,17.34 5.07,13.6 v6.21,13.6 | v6.21,10.37 6.21,9.1 | 6.21,9.1 4.72,9.1 4.72,9.16 4.71,9.38 4.72,9.7 | R12.2 6.78,8.4 6.28,8.9 6.21,9.1
XTAL1
  Bottom 0.203: Q1.4 20.82,12.82 20.24,12.24 IC1.9
XTAL2  (via drill 0.5)
  Top 0.203: v18.6,14.72 v20.82,16.94
  Bottom 0.203: v20.82,16.94 Q1.1 | v18.6,14.72 18.6,13.14 17.7,12.24 IC1.10

### Text on the board
bPlace: License: http://goo.gl/3d71UJ
tNames: GND | OpenTRV.org.uk | 5 | B | GND | 3.3 | Wireless TRV | (& boiler) controller | Rev 3(1) | 20140517
bNames: "replace milling with slot drilling if rqd" / "min 2.1mm x 1.8mm"